# EAGLE design G021Kng (EAGLE 6.6.0)
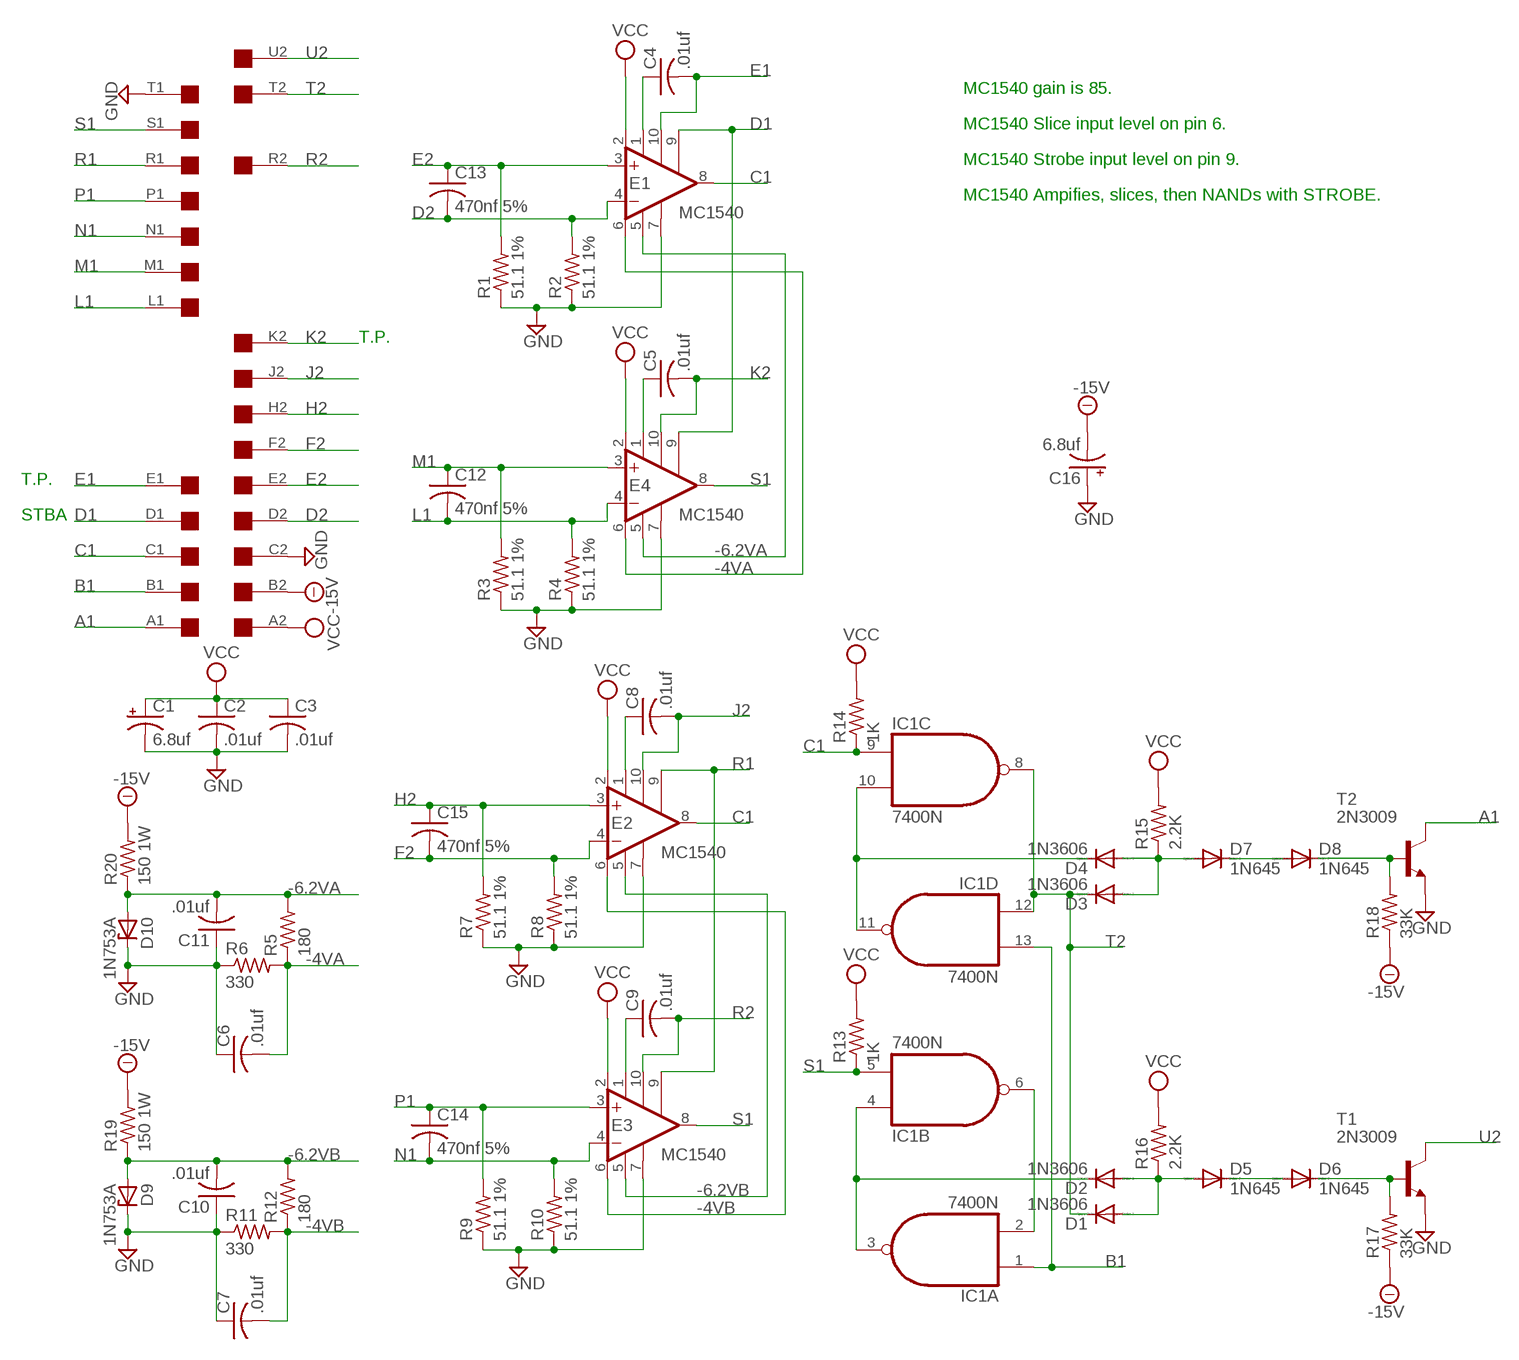
[diagram p0: schematic, sheet 1]

## Parts
C1  6.8uf  CPOL-USE22-6AXIAL  [E22-6]
C2  .01uf  C-US050-025X075  [C050-025X075]
C3  .01uf  C-US050-025X075  [C050-025X075]
C4  .01uf  C-US050-025X075  [C050-025X075]
C5  .01uf  C-US050-025X075  [C050-025X075]
C6  .01uf  C-US050-025X075  [C050-025X075]
C7  .01uf  C-US050-025X075  [C050-025X075]
C8  .01uf  C-US050-025X075  [C050-025X075]
C9  .01uf  C-US050-025X075  [C050-025X075]
C10  .01uf  C-US050-025X075  [C050-025X075]
C11  .01uf  C-US050-025X075  [C050-025X075]
C12  470nf 5%  C-US050-025X075  [C050-025X075]
C13  470nf 5%  C-US050-025X075  [C050-025X075]
C14  470nf 5%  C-US050-025X075  [C050-025X075]
C15  470nf 5%  C-US050-025X075  [C050-025X075]
C16  6.8uf  CPOL-USE22-6AXIAL  [E22-6]
D1  1N3606  1N4148DO35-10  [DO35-10]
D2  1N3606  1N4148DO35-10  [DO35-10]
D3  1N3606  1N4148DO35-10  [DO35-10]
D4  1N3606  1N4148DO35-10  [DO35-10]
D5  1N645  1N4148DO35-10  [DO35-10]
D6  1N645  1N4148DO35-10  [DO35-10]
D7  1N645  1N4148DO35-10  [DO35-10]
D8  1N645  1N4148DO35-10  [DO35-10]
D9  1N753A  ZENER-DIODEF126-10  [F126Z10]
D10  1N753A  ZENER-DIODEF126-10  [F126Z10]
E1  MC1540  MC1540G  [602B]
E2  MC1540  MC1540G  [602B]
E3  MC1540  MC1540G  [602B]
E4  MC1540  MC1540G  [602B]
EDGE  EDGE-2ECONO  [ECONOSINGLE]
IC1  7400N  [DIL14]
R1  51.1 1%  R-US_0207/10  [0207/10]
R2  51.1 1%  R-US_0207/10  [0207/10]
R3  51.1 1%  R-US_0207/10  [0207/10]
R4  51.1 1%  R-US_0207/10  [0207/10]
R5  180  R-US_0207/10  [0207/10]
R6  330  R-US_0207/10  [0207/10]
R7  51.1 1%  R-US_0207/10  [0207/10]
R8  51.1 1%  R-US_0207/10  [0207/10]
R9  51.1 1%  R-US_0207/10  [0207/10]
R10  51.1 1%  R-US_0207/10  [0207/10]
R11  330  R-US_0207/10  [0207/10]
R12  180  R-US_0207/10  [0207/10]
R13  1K  R-US_0207/10  [0207/10]
R14  1K  R-US_0207/10  [0207/10]
R15  2.2K  R-US_0207/10  [0207/10]
R16  2.2K  R-US_0207/10  [0207/10]
R17  33K  R-US_0207/10  [0207/10]
R18  33K  R-US_0207/10  [0207/10]
R19  150 1W  R-US_0414/15  [0414/15]
R20  150 1W  R-US_0414/15  [0414/15]
T1  2N3009  2N3565  [TO92]
T2  2N3009  2N3565  [TO92]

## Nets
-4VA: C6.2 E1.6(SLICE) E4.6(SLICE) R5.1 R6.2
-4VB: C7.2 E2.6(SLICE) E3.6(SLICE) R11.2 R12.1
-6.2VA: C11.2 D10.A E1.5(V-) E4.5(V-) R5.2 R20.1
-6.2VB: C10.2 D9.A E2.5(V-) E3.5(V-) R12.2 R19.1
-15V: C16.- EDGE.B2 R17.1 R18.1 R19.2 R20.2
A1: EDGE.A1 T2.1(C)
B1: EDGE.B1 IC1.1(A:I0) IC1.13(D:I1)
C1: E1.8(OUT) E2.8(OUT) EDGE.C1 IC1.9(C:I0) R14.1
D1: E1.9(ISTROBE) E4.9(ISTROBE) EDGE.D1
D2: C13.2 E1.4(-IN) EDGE.D2 R2.2
E1: C4.2 E1.10(CEXTB) EDGE.E1
E2: C13.1 E1.3(+IN) EDGE.E2 R1.2
F2: C15.2 E2.4(-IN) EDGE.F2 R8.2
GND: C1.- C2.2 C3.2 C6.1 C7.1 C10.1 C11.1 C16.+ D9.C D10.C E1.7(GND) E2.7(GND) E3.7(GND) E4.7(GND) EDGE.C2 EDGE.T1 R1.1 R2.1 R3.1 R4.1 R6.1 R7.1 R8.1 R9.1 R10.1 R11.1 T1.3(E) T2.3(E)
H2: C15.1 E2.3(+IN) EDGE.H2 R7.2
J2: C8.2 E2.10(CEXTB) EDGE.J2
K2: C5.2 E4.10(CEXTB) EDGE.K2
L1: C12.2 E4.4(-IN) EDGE.L1 R4.2
M1: C12.1 E4.3(+IN) EDGE.M1 R3.2
N1: C14.2 E3.4(-IN) EDGE.N1 R10.2
N$1: C4.1 E1.1(CEXTA)
N$2: C8.1 E2.1(CEXTA)
N$3: C5.1 E4.1(CEXTA)
N$4: C9.1 E3.1(CEXTA)
N$6: D1.A D2.A D5.A R16.1
N$7: D4.C IC1.10(C:I1) IC1.11(D:O)
N$8: D2.C IC1.3(A:O) IC1.4(B:I0)
N$9: IC1.2(A:I1) IC1.6(B:O)
N$10: D3.A D4.A D7.A R15.1
N$11: D7.C D8.A
N$12: D5.C D6.A
N$13: D8.C R18.2 T2.2(B)
N$14: D6.C R17.2 T1.2(B)
P1: C14.1 E3.3(+IN) EDGE.P1 R9.2
R1: E2.9(ISTROBE) E3.9(ISTROBE) EDGE.R1
R2: C9.2 E3.10(CEXTB) EDGE.R2
S1: E3.8(OUT) E4.8(OUT) EDGE.S1 IC1.5(B:I1) R13.1
T2: D1.C D3.C EDGE.T2 IC1.8(C:O) IC1.12(D:I0)
U2: EDGE.U2 T1.1(C)
VCC: C1.+ C2.1 C3.1 E1.2(V+) E2.2(V+) E3.2(V+) E4.2(V+) EDGE.A2 R13.2 R14.2 R15.2 R16.2
Unconnected: EDGE.F1 EDGE.H1 EDGE.J1 EDGE.K1 EDGE.L2 EDGE.M2 EDGE.N2 EDGE.P2 EDGE.S2 EDGE.U1 EDGE.V1 EDGE.V2

## Notes on the sheet
- MC1540 gain is 85.
- MC1540 Slice input level on pin 6.
- MC1540 Strobe input level on pin 9.
- MC1540 Ampifies, slices, then NANDs with STROBE.
- T.P.
- T.P.
- STBA

## Power pins joined to a net without a drawn wire
GND: IC1.7(P:GND)
VCC: IC1.14(P:VCC)

## Library data of the parts
C1 C16 = rcl:CPOL-US: POLARIZED CAPACITOR, American symbol
C2-C15 = rcl:C-US: CAPACITOR, American symbol
D1-D8 = diode:1N4148: DIODE high speed (Philips)
D9 D10 = diode:ZENER-DIODE: Z-Diode
E1-E4 = dec-con:MC1540: OP AMP
EDGE = dec-con:EDGE-2: Double-Sided DEC edge connector.
IC1 = 74xx-us:74*00: Quad 2-input NAND gate
R1-R20 = rcl:R-US_: RESISTOR, American symbol
T1 T2 = transistor:2N3565: NPN TRANSISTOR

## Board
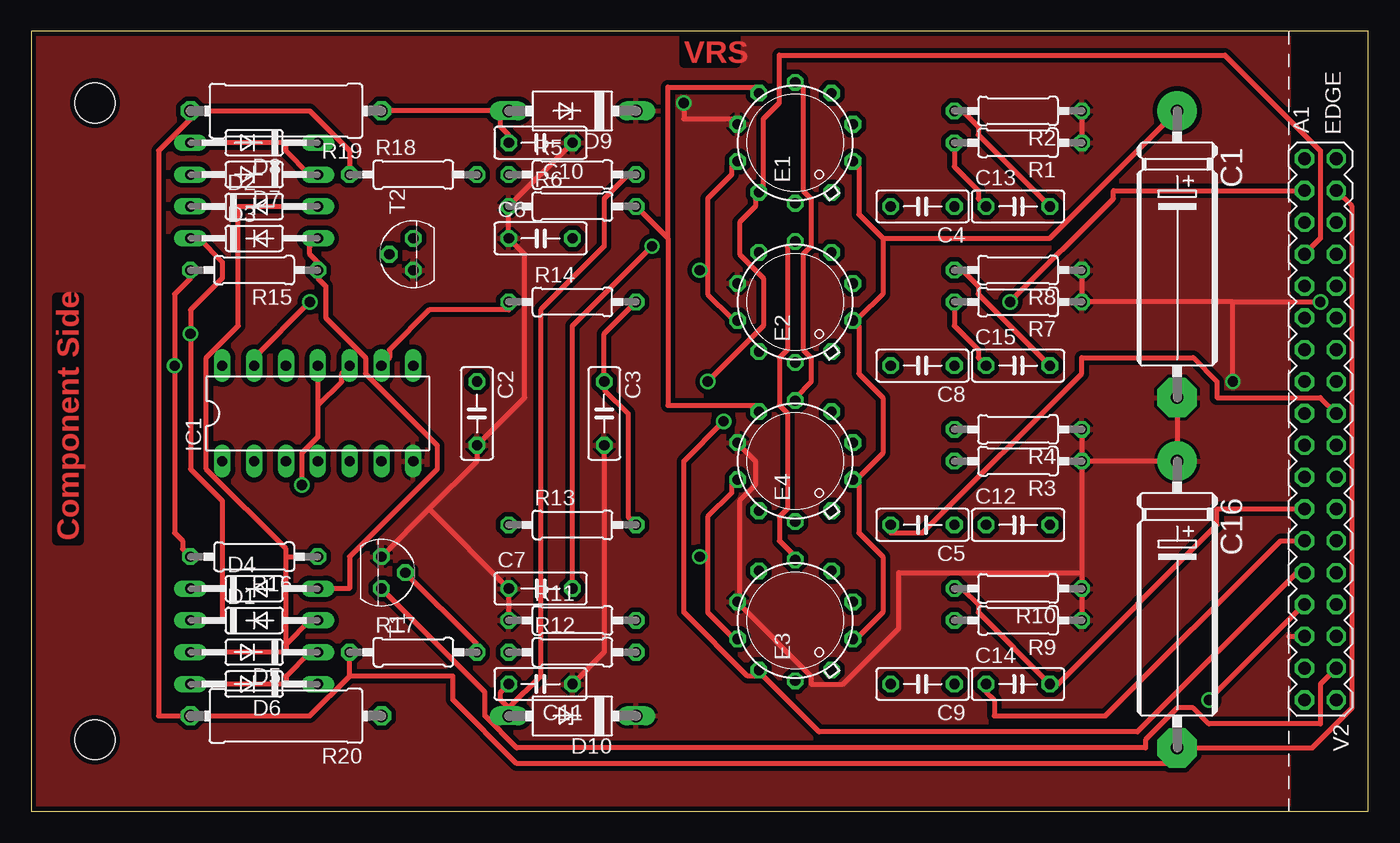
[diagram p1: board, top side]
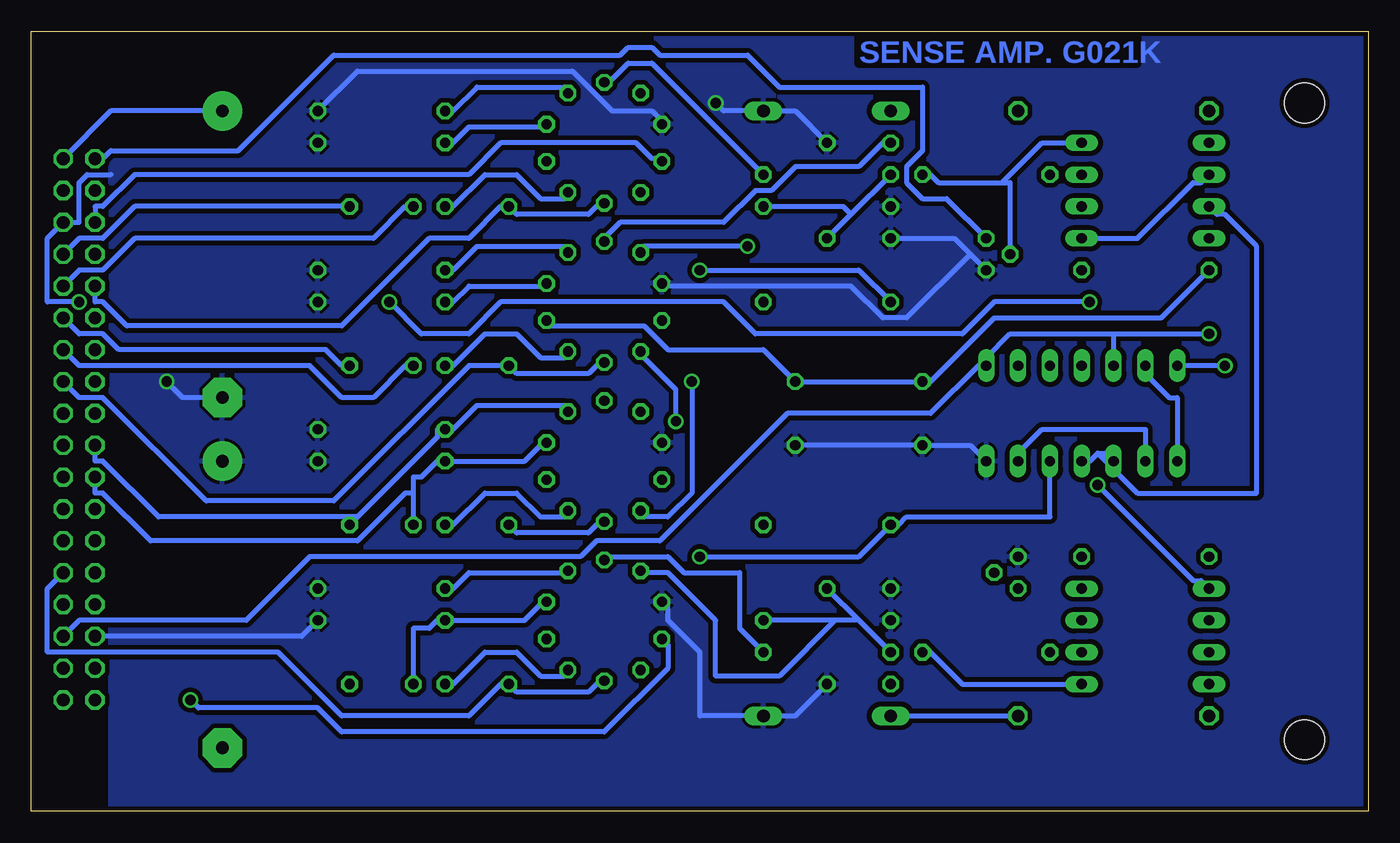
[diagram p2: board, bottom side, seen from below]

Size 106.68 x 62.23 mm. Coordinates in mm from the lower left corner, seen from the top.
Copper layers (1+16): Top 0.035mm / dielectric 1.5mm / Bottom 0.035mm
Design rules "16mils": minimum track width 16mil, minimum drill 32mil, track to track 15mil, track to pad 10mil, pad to pad 10mil, via to via 10mil, smd to smd 10mil, copper to edge 13mil, drill to drill 10mil, minimum pad ring 10mil, minimum via ring 8mil, stop-mask expansion 0mil, vias tented up to drill 0mil, thermal gap 10mil

### Footprints (pad centres in the part's own frame; a part is rotated, then mirrored left to right if it is on the bottom)
E22-6 = drill 1.016 pad 3.15: + -11.43,0 | drill 1.016 pad 3.15 octagon: - 11.43,0
C050-025X075 = drill 0.813 octagon: 1 -2.54,0; 2 2.54,0
DO35-10 = drill 0.813 long: A 5.08,0; C -5.08,0
F126Z10 = drill 1.016 long: A 5.08,0; C -5.08,0
602B = drill 0.813 octagon: 1 -3.954,-2.897; 2 -1.478,-4.605; 3 1.478,-4.605; 4 3.954,-2.897; 5 4.825,0; 6 3.954,2.897; 7 1.478,4.605; 8 -1.477,4.605; 9 -3.954,2.897; 10 -4.825,0
ECONOSINGLE = drill 1.016 octagon: A1 5.08,10.16; A2 2.54,10.16; B1 5.08,12.7; B2 2.54,12.7; C1 5.08,15.24; C2 2.54,15.24; D1 5.08,17.78; D2 2.54,17.78; E1 5.08,20.32; E2 2.54,20.32; F1 5.08,22.86; F2 2.54,22.86; H1 5.08,25.4; H2 2.54,25.4; J1 5.08,27.94; J2 2.54,27.94; K1 5.08,30.48; K2 2.54,30.48; L1 5.08,33.02; L2 2.54,33.02; M1 5.08,35.56; M2 2.54,35.56; N1 5.08,38.1; N2 2.54,38.1; P1 5.08,40.64; P2 2.54,40.64; R1 5.08,43.18; R2 2.54,43.18; S1 5.08,45.72; S2 2.54,45.72; T1 5.08,48.26; T2 2.54,48.26; U1 5.08,50.8; U2 2.54,50.8; V1 5.08,53.34; V2 2.54,53.34 | hole 3.175: 101.6,56.515; 101.6,5.715
DIL14 = drill 0.813 long: 1 -7.62,-3.81; 2 -5.08,-3.81; 3 -2.54,-3.81; 4 0,-3.81; 5 2.54,-3.81; 6 5.08,-3.81; 7 7.62,-3.81; 8 7.62,3.81; 9 5.08,3.81; 10 2.54,3.81; 11 0,3.81; 12 -2.54,3.81; 13 -5.08,3.81; 14 -7.62,3.81
0207/10 = drill 0.813 octagon: 1 -5.08,0; 2 5.08,0
0414/15 = drill 1.016 octagon: 1 -7.62,0; 2 7.62,0
TO92 = drill 0.813 octagon: 1 1.27,0; 2 0,1.905; 3 -1.27,0

### Placement (x,y rotation side)
C1  91.44,44.45 270 top
C2  35.56,31.75 270 top
C3  45.72,31.75 270 top
C4  71.12,48.26 180 top
C5  71.12,22.86 180 top
C6  40.64,45.72 0 top
C7  40.64,17.78 0 top
C8  71.12,35.56 180 top
C9  71.12,10.16 180 top
C10  40.64,53.34 180 top
C11  40.64,10.16 180 top
C12  78.74,22.86 0 top
C13  78.74,48.26 0 top
C14  78.74,10.16 0 top
C15  78.74,35.56 0 top
C16  91.44,16.51 270 top
D1  17.78,15.24 0 top
D2  17.78,48.26 0 top
D3  17.78,45.72 0 top
D4  17.78,17.78 0 top
D5  17.78,12.7 180 top
D6  17.78,10.16 180 top
D7  17.78,50.8 180 top
D8  17.78,53.34 180 top
D9  43.18,55.88 180 top
D10  43.18,7.62 180 top
E1  60.96,53.34 90 top
E2  60.96,40.64 90 top
E3  60.96,15.24 90 top
E4  60.96,27.94 90 top
EDGE  106.68,62.23 180 top
IC1  22.86,31.75 0 top
R1  78.74,53.34 180 top
R2  78.74,55.88 180 top
R3  78.74,27.94 180 top
R4  78.74,30.48 180 top
R5  43.18,50.8 0 top
R6  43.18,48.26 0 top
R7  78.74,40.64 180 top
R8  78.74,43.18 180 top
R9  78.74,15.24 180 top
R10  78.74,17.78 180 top
R11  43.18,15.24 0 top
R12  43.18,12.7 0 top
R13  43.18,22.86 0 top
R14  43.18,40.64 0 top
R15  17.78,43.18 180 top
R16  17.78,20.32 180 top
R17  30.48,12.7 0 top
R18  30.48,50.8 0 top
R19  20.32,55.88 180 top
R20  20.32,7.62 180 top
T1  27.94,19.05 270 top
T2  30.48,44.45 90 top

### Tracks (layer width: path | path; a pad name or v marks a point on that pad's centre or on a via)
-4VA
  Top 0.406: 50.8,45.72 50.8,32.38 57.78,32.38 E4.6 | R6.2 50.8,45.72 | 50.8,45.72 50.8,57.78 57.78,57.78 E1.6
  Bottom 0.406: C6.2 41.27,47.62 | 41.27,47.62 R5.1 | 41.27,47.62 41.91,48.26 R6.2
-4VB  (via drill 0.81)
  Top 0.406: v49.53,45.09 43.18,38.73 C7.2
  Bottom 0.406: C7.2 40.64,15.24 | 40.64,15.24 R12.1 | 40.64,15.24 42.55,15.24 | 42.55,15.24 R11.2 | 42.55,15.24 46.99,10.79 52.07,10.79 52.07,15.24 55.88,19.05 57.78,19.05 E3.6 | v49.53,45.09 57.78,45.09 E2.6
-6.2VA
  Top 0.406: C11.2 37.47,9.53 37.47,8.89 38.1,8.26 | E4.5 60.96,33.02 62.23,34.29 62.23,36.2 61.59,36.83 61.59,44.45 62.23,45.09 62.23,48.9 61.59,49.53 61.59,57.78 60.96,58.42 E1.5 | 38.1,8.26 40.64,10.79 40.64,40.01 45.72,45.09 45.72,48.9 47.62,50.8 R5.2 | 38.1,8.26 D10.A
  Bottom 0.406: D10.A R20.1 | R5.2 57.15,59.69 59.05,59.69 60.33,58.42 60.96,58.42 E1.5
-6.2VB
  Top 0.406: 37.47,55.88 R19.1 | 37.47,55.88 37.47,54.61 38.1,53.98 C10.2 | 37.47,55.88 D9.A | E3.5 60.96,20.32 59.69,21.59 59.69,23.5 60.33,24.13 60.33,31.75 59.69,32.38 59.69,36.2 60.33,36.83 60.33,45.09 60.96,45.72 E2.5
  Bottom 0.406: R12.2 50.16,14.61 50.16,19.05 54.61,19.05 55.88,20.32 60.96,20.32 E3.5 | C10.2 38.73,53.34 40.64,51.44 45.72,51.44 47.62,49.53 48.9,49.53 51.44,46.99 59.69,46.99 60.96,45.72 E2.5
-15V
  Top 0.406: 25.4,10.79 R17.1 | 25.4,10.79 22.23,7.62 R20.2 10.16,7.62 10.16,52.7 12.7,55.24 R19.2 22.23,55.88 25.4,52.7 R18.1 | EDGE.B2 105.41,48.26 105.41,8.26 102.23,5.08 C16.- 91.44,3.81 38.73,3.81 33.66,8.89 33.66,10.79 25.4,10.79
A1
  Bottom 0.406: T2.1 33.66,48.9 35.56,48.9 36.83,50.16 36.83,51.44 35.56,52.7 35.56,57.78 46.99,57.78 49.53,60.33 56.52,60.33 57.15,60.96 59.05,60.96 59.69,60.33 82.55,60.33 90.17,52.7 100.33,52.7 100.97,52.07 EDGE.A1
B1  (via drill 0.81)
  Top 0.406: EDGE.B1 86.36,49.53 86.36,48.9 v78.11,40.64 | v22.23,40.64 17.78,36.2 IC1.13
  Bottom 0.406: IC1.1 15.24,33.02 15.88,33.02 17.78,34.92 IC1.13 | v78.11,40.64 75.56,38.1 71.75,38.1 69.22,40.64 51.44,40.64 48.9,38.1 32.38,38.1 29.84,40.64 v22.23,40.64
C1  (via drill 0.81)
  Top 0.406: IC1.9 28.57,36.2 28.57,36.83 31.75,40.01 38.1,40.01 R14.1 | 53.98,43.18 53.98,48.9 55.88,50.8 55.88,51.44 E1.8 | 53.98,43.18 53.98,41.27 55.88,39.37 E2.8 | 53.98,43.18 v53.34,43.18
  Bottom 0.406: EDGE.C1 101.6,48.26 100.97,48.26 98.42,50.8 71.75,50.8 69.22,53.34 58.42,53.34 57.15,52.07 56.52,52.07 E1.8 | R14.1 40.64,43.18 v53.34,43.18
D1  (via drill 0.81)
  Top 0.406: v53.98,34.29 58.42,38.73 58.42,42.55 56.52,44.45 56.52,46.99 57.78,48.26 57.78,48.9 E1.9 58.42,49.53 58.42,55.24 59.69,56.52 59.69,60.33 95.25,60.33 102.87,52.7 102.87,45.72 EDGE.D1
  Bottom 0.406: v53.98,34.29 53.98,25.4 55.88,23.5 57.78,23.5 E4.9
D2
  Top 0.406: C13.2 75.56,53.98 75.56,54.61 74.3,55.88 R2.2
  Bottom 0.406: R2.2 73.03,55.88 71.12,57.78 64.14,57.78 E1.4 | EDGE.D2 102.87,45.72 100.97,45.72 98.42,48.26 C13.2
E1
  Bottom 0.406: E1.10 60.96,48.26 61.59,48.26 62.23,47.62 67.94,47.62 C4.2 69.22,48.26 71.75,45.72 74.93,45.72 81.92,38.73 99.06,38.73 100.97,40.64 101.6,40.64 EDGE.E1
E2
  Top 0.406: C13.1 75.56,48.9 75.56,49.53 73.66,51.44 R1.2
  Bottom 0.406: R1.2 73.03,53.34 71.75,54.61 66.04,54.61 E1.3 | EDGE.E2 102.87,43.18 100.97,43.18 98.42,45.72 79.38,45.72 76.83,48.26 C13.1
F2
  Top 0.406: C15.2 75.56,41.27 75.56,41.91 74.3,43.18 R8.2
  Bottom 0.406: R8.2 73.03,43.18 71.12,45.09 64.14,45.09 E2.4 | EDGE.F2 102.87,38.1 100.97,38.1 99.69,36.83 83.19,36.83 81.92,35.56 C15.2
GND  (via drill 0.81)
  Top 0.406: 100.33,13.97 EDGE.T1 | R2.1 R1.1 | C10.1 R6.1 C6.1 39.37,44.45 39.37,33.02 C2.2 35.56,27.94 31.75,24.13 | v52.07,56.52 52.07,55.24 55.88,55.24 E1.7 | R9.1 R10.1 83.82,19.05 | R4.1 R3.1 | R3.1 C16.+ C1.- | R8.1 R7.1 95.89,40.64 | v95.89,34.29 95.89,40.64 | 95.89,40.64 v102.87,40.64 | R3.1 83.82,19.05 | E4.7 56.52,29.21 57.78,27.94 57.78,26.04 56.52,24.77 56.52,17.14 E3.7 56.52,16.51 62.23,10.79 62.23,10.16 64.77,10.16 69.22,14.61 69.22,19.05 83.82,19.05 | R11.1 C7.1 31.75,24.13 | 31.75,24.13 T1.3 | C11.1 45.72,12.7 C3.2
  Bottom 0.406: 100.33,50.8 102.23,50.8 102.87,50.16 102.87,46.99 EDGE.C2 105.41,45.72 105.41,40.64 v102.87,40.64 | R2.1 80.64,59.05 63.5,59.05 60.33,55.88 57.15,55.88 56.52,55.24 E1.7 | C10.1 45.72,55.88 D9.C 51.44,55.88 v52.07,56.52 | 31.75,44.45 33.02,45.72 C6.1 | 31.75,44.45 T2.3 | 31.75,44.45 36.83,39.37 38.73,39.37 41.27,41.91 55.88,41.91 E2.7 | EDGE.T1 85.09,13.97 R9.1 | v95.89,34.29 94.61,33.02 C1.- | C11.1 45.72,7.62 D10.C 53.34,7.62 53.34,12.7 55.88,15.24 55.88,16.51 E3.7 | IC1.7 31.75,29.21 C2.2 C3.2
  pour Top (isolate 0.381): 0,0 99.95,0 100.33,0.38 100.33,62.23 0.38,62.23 0,61.85
  pour Bottom (isolate 0.381): 0,0 99.95,0 100.33,0.38 100.33,62.23 0.38,62.23 0,61.85
H2
  Top 0.406: C15.1 75.56,36.2 75.56,36.83 73.66,38.73 R7.2
  Bottom 0.406: R7.2 73.03,40.64 71.75,41.91 66.04,41.91 E2.3 | EDGE.H2 102.87,35.56 84.45,35.56 81.92,33.02 79.38,33.02 76.83,35.56 C15.1
J2
  Bottom 0.406: E2.10 60.96,35.56 61.59,35.56 62.23,34.92 67.94,34.92 C8.2 71.75,35.56 82.55,24.77 92.71,24.77 100.97,33.02 102.87,33.02 EDGE.J2
K2
  Top 0.406: EDGE.K2 102.87,33.02 94.61,33.02 94.61,34.29 92.71,36.2 83.82,36.2 83.82,34.92 71.12,22.23 68.58,22.23 C5.2
  Bottom 0.406: C5.2 67.94,22.23 62.23,22.23 61.59,22.86 60.96,22.86 E4.10
L1
  Bottom 0.406: E4.4 64.14,32.38 71.12,32.38 73.03,30.48 R4.2 74.3,30.48 74.3,29.84 80.64,23.5 | 80.64,23.5 C12.2 | EDGE.L1 101.6,27.94 100.97,27.94 96.52,23.5 80.64,23.5
M1
  Bottom 0.406: E4.3 66.04,29.21 67.31,27.94 R3.2 74.3,27.94 75.56,26.67 76.2,26.67 76.2,25.4 | 76.2,25.4 C12.1 | EDGE.M1 101.6,25.4 100.97,25.4 97.16,21.59 80.64,21.59 76.83,25.4 76.2,25.4
N1
  Top 0.406: R10.2 74.3,17.78 75.56,16.51 75.56,15.88 C14.2 81.92,10.16 94.61,22.86 94.61,24.13 EDGE.N1
  Bottom 0.406: R10.2 73.03,17.78 71.75,19.05 64.14,19.05 E3.4
N$1
  Bottom 0.406: C4.1 73.03,48.26 70.48,50.8 67.94,50.8 66.04,48.9 64.14,48.9 E1.1
N$2
  Bottom 0.406: C8.1 73.03,35.56 70.48,38.1 67.94,38.1 66.04,36.2 64.14,36.2 E2.1
N$3
  Bottom 0.406: C5.1 73.03,22.86 70.48,25.4 67.94,25.4 66.04,23.5 64.14,23.5 E4.1
N$4
  Bottom 0.406: C9.1 73.03,10.16 70.48,12.7 67.94,12.7 66.04,10.79 64.14,10.79 E3.1
N$6
  Top 0.406: D5.A 20.32,12.7 20.32,13.34 | 20.32,13.34 22.23,15.24 D1.A | 20.32,20.32 R16.1 | 20.32,13.34 20.32,20.32 | D2.A 16.51,48.26 16.51,38.73 13.97,36.2 13.97,27.3 20.32,20.95 20.32,20.32
N$7  (via drill 0.81)
  Top 0.406: v21.59,26.04 21.59,28.57 22.86,29.84 22.86,32.38 | IC1.11 22.86,32.38 | IC1.10 24.77,34.92 24.77,34.29 22.86,32.38
  Bottom 0.406: D4.C 13.34,18.41 13.97,18.41 v21.59,26.04
N$8
  Bottom 0.406: IC1.3 20.95,28.57 21.59,28.57 | 21.59,28.57 22.23,27.94 IC1.4 | D2.C 12.06,47.62 11.43,47.62 8.89,45.09 8.89,25.4 18.41,25.4 21.59,28.57
N$9
  Bottom 0.406: IC1.2 17.78,30.48 26.04,30.48 27.94,28.57 IC1.6
N$10
  Top 0.406: D4.A 25.4,17.78 25.4,20.32 32.38,27.3 32.38,29.21 26.67,34.92 26.67,36.2 23.5,39.37 23.5,41.91 22.86,42.55 R15.1 22.86,43.81 22.23,44.45 22.23,45.09 D3.A
  Bottom 0.406: D7.A 13.34,50.16 13.97,50.16 18.41,45.72 D3.A
N$11
  Top 0.406: D8.A 20.32,53.34 20.32,52.7 22.23,50.8 D7.C
N$12
  Top 0.406: D6.A 20.32,10.16 20.32,10.79 22.23,12.7 D5.C
N$13
  Bottom 0.406: T2.2 28.57,50.16 29.21,50.16 | 29.21,50.16 34.29,50.16 34.92,50.8 R18.2 | D8.C 26.04,53.34 29.21,50.16
N$14
  Top 0.406: T1.2 35.56,13.34 R17.2
  Bottom 0.406: D6.C 32.38,10.16 34.92,12.7 R17.2
P1
  Top 0.406: EDGE.P1 99.69,21.59 85.72,7.62 76.83,7.62 76.83,8.89 76.2,9.53 C14.1
  Bottom 0.406: E3.3 66.04,16.51 67.31,15.24 R9.2 74.3,15.24 74.93,14.61 76.2,14.61 C14.1
R1  (via drill 0.81)
  Top 0.406: EDGE.R1 100.97,19.05 88.27,6.35 62.87,6.35 58.42,10.79 E3.9 57.78,10.79 57.15,10.79 52.07,15.88 52.07,27.94 v55.24,31.11
  Bottom 0.406: v55.24,31.11 55.24,33.66 57.78,36.2 E2.9
R2
  Bottom 0.406: E3.10 60.96,10.16 61.59,10.16 62.23,9.53 67.94,9.53 C9.2 69.22,10.16 71.75,7.62 81.92,7.62 87,12.7 105.41,12.7 105.41,17.78 EDGE.R2
S1  (via drill 0.81)
  Top 0.406: 53.98,20.32 53.98,23.5 55.88,25.4 55.88,26.04 E4.8 | 53.98,20.32 53.98,15.88 55.88,13.97 E3.8 | v93.98,8.89 EDGE.S1 | 53.98,20.32 v53.34,20.32
  Bottom 0.406: IC1.5 25.4,23.5 36.83,23.5 37.47,22.86 R13.1 40.64,20.32 v53.34,20.32 | v93.98,8.89 93.34,8.26 83.82,8.26 81.92,6.35 60.96,6.35 55.88,11.43 55.88,13.34 E3.8
T2  (via drill 0.81)
  Top 0.406: D1.C 15.24,15.24 15.24,24.77 12.7,27.3 v12.7,38.1 12.7,40.01 15.24,42.55 15.24,43.81 13.34,45.72 D3.C
  Bottom 0.406: 20.32,38.1 IC1.12 | 20.32,38.1 28.57,38.1 30.48,36.2 IC1.8 31.11,35.56 34.92,31.75 46.35,31.75 56.52,21.59 61.59,21.59 62.87,20.32 84.45,20.32 89.53,15.24 102.87,15.24 EDGE.T2 | 20.32,38.1 v12.7,38.1
U2
  Top 0.406: T1.1 36.2,9.53 36.2,7.62 38.73,5.08 88.9,5.08 88.9,5.71 91.44,8.26 92.71,8.26 93.98,6.99 102.87,6.99 102.87,10.16 EDGE.U2
VCC  (via drill 0.81)
  Top 0.406: R16.2 12.06,20.95 12.06,21.59 11.43,22.23 v11.43,35.56 11.43,41.27 12.7,42.55 R15.2 | R13.2 47.62,23.5 47.62,31.75 45.72,33.66 C3.1 45.72,38.1 R14.2 | E3.2 66.04,13.97 67.94,15.88 67.94,20.32 66.04,22.23 66.04,26.04 E4.2 66.04,26.67 67.94,28.57 67.94,33.02 66.04,34.92 66.04,38.73 E2.2 66.04,39.37 67.94,41.27 67.94,45.72 | 67.94,45.72 66.04,47.62 66.04,51.44 E1.2 | C1.+ 81.28,45.72 67.94,45.72
  Bottom 0.406: v11.43,35.56 IC1.14 | R15.2 16.51,39.37 29.84,39.37 34.92,34.29 C2.1 C3.1 48.26,36.83 55.88,36.83 57.78,38.73 65.41,38.73 E2.2 | EDGE.A2 100.33,55.88 C1.+

### Text on the board
Top: VRS | Component Side
Bottom: SENSE AMP. G021K
Document: Layout is based on G021H.